# Altium schematic sheet isolation.SchDoc
size A4; SheetNumber: 4; SheetTotal: 13
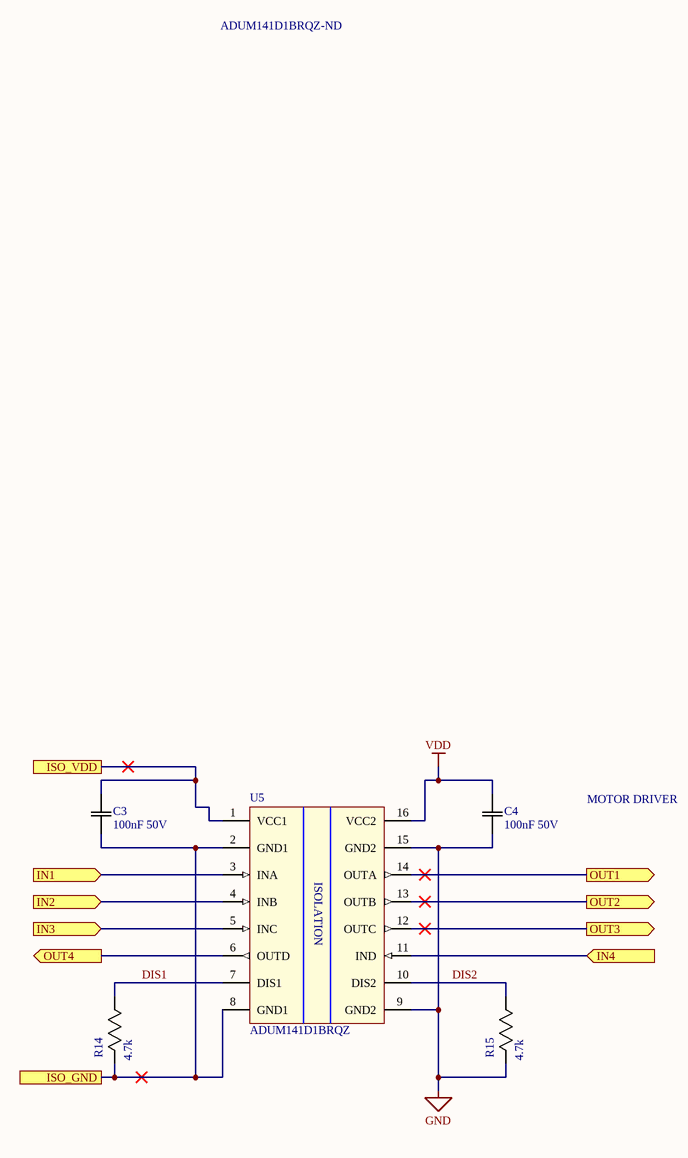
[diagram p0: isolation.SchDoc]

## Parts
C3  100nF 50V  [0603]
C4  100nF 50V  [0603]
R14  4.7k  [0603]
R15  4.7k  [0603]
U5  ADUM141D1BRQZ  Supplier Part Number 1: ADUM141D1BRQZ-ND  [SOP64P600X175-16N]

## Ports
IN1 (in), IN2 (in), IN3 (in), IN4 (in), ISO_GND, ISO_VDD, OUT1 (out), OUT2 (out), OUT3 (out), OUT4 (out)

## Nets
GND: C4.1(C1) R15.2(R2) U5.9(GND2) U5.15(GND2)
VDD: C4.2(C2) U5.16(VCC2)
DIS1: R14.1(R1) U5.7(DIS1)
DIS2: R15.1(R1) U5.10(DIS2)
IN1: U5.3(INA) ; port IN1
IN2: U5.4(INB) ; port IN2
IN3: U5.5(INC) ; port IN3
IN4: U5.11(IND) ; port IN4
ISO_GND: C3.1(C1) R14.2(R2) U5.2(GND1) U5.8(GND1) ; port ISO_GND
ISO_VDD: C3.2(C2) U5.1(VCC1) ; port ISO_VDD
OUT1: U5.14(OUTA) ; port OUT1
OUT2: U5.13(OUTB) ; port OUT2
OUT3: U5.12(OUTC) ; port OUT3
OUT4: U5.6(OUTD) ; port OUT4

## Notes on the sheet
- MOTOR DRIVER
- (in symbol ISO ADUM141D1BRQZ) ISOLATION

## Library data of the parts
C3 C4 = CAP 100nF 50V: Default Symbol for Capacitors; Manufacturer Part Number 1: CC0603KPX7R9BB104; Temperature Coefficient: X7R; Tolerance: 10%; Part Number: CAP 100nF 50V; Supplier 1: Digi-Key; Supplier Part Number 1: 311-3567-1-ND; Manufacturer Part Number 2: 0805J0500104KJT; Supplier 2: Digi-Key; Supplier Part Number 2: 1608-1458-1-ND; Value: 100nF; Rating: 50V
R14 R15 = RES 4.7k 1/8W - 5%: Default Resistor Symbol; Manufacturer Part Number 1: RMCF0603JT4K70; Power (Watts): 0.125W; Tolerance: 5%; Package: 0805; Value: 4.7k; Part Number: RES 4.7k 1/8W - 5%; Supplier 1: Digi-Key; Supplier Part Number 1: RMCF0603JT4K70CT-ND; Supplier URL 1: https://www.digikey.ca/en/products/detail/stackpole-electronics-inc/RMCF0603JT4K70/1757976
U5 = ISO ADUM141D1BRQZ: Digital Isolator CMOS 4-CH 150Mbps 16-Pin QSOP T/R; Supplier 1: Digi-Key; Part Number: ISO ADUM141D1BRQZ; Supplier URL 1: https://www.digikey.ca/en/products/detail/analog-devices-inc/ADUM141D1BRQZ/7606661; Manufacturer Part Number 1: ADUM141D1BRQZ